# EAGLE design gps_transmitter_featherwing_v1.0 (EAGLE 7.7.0)
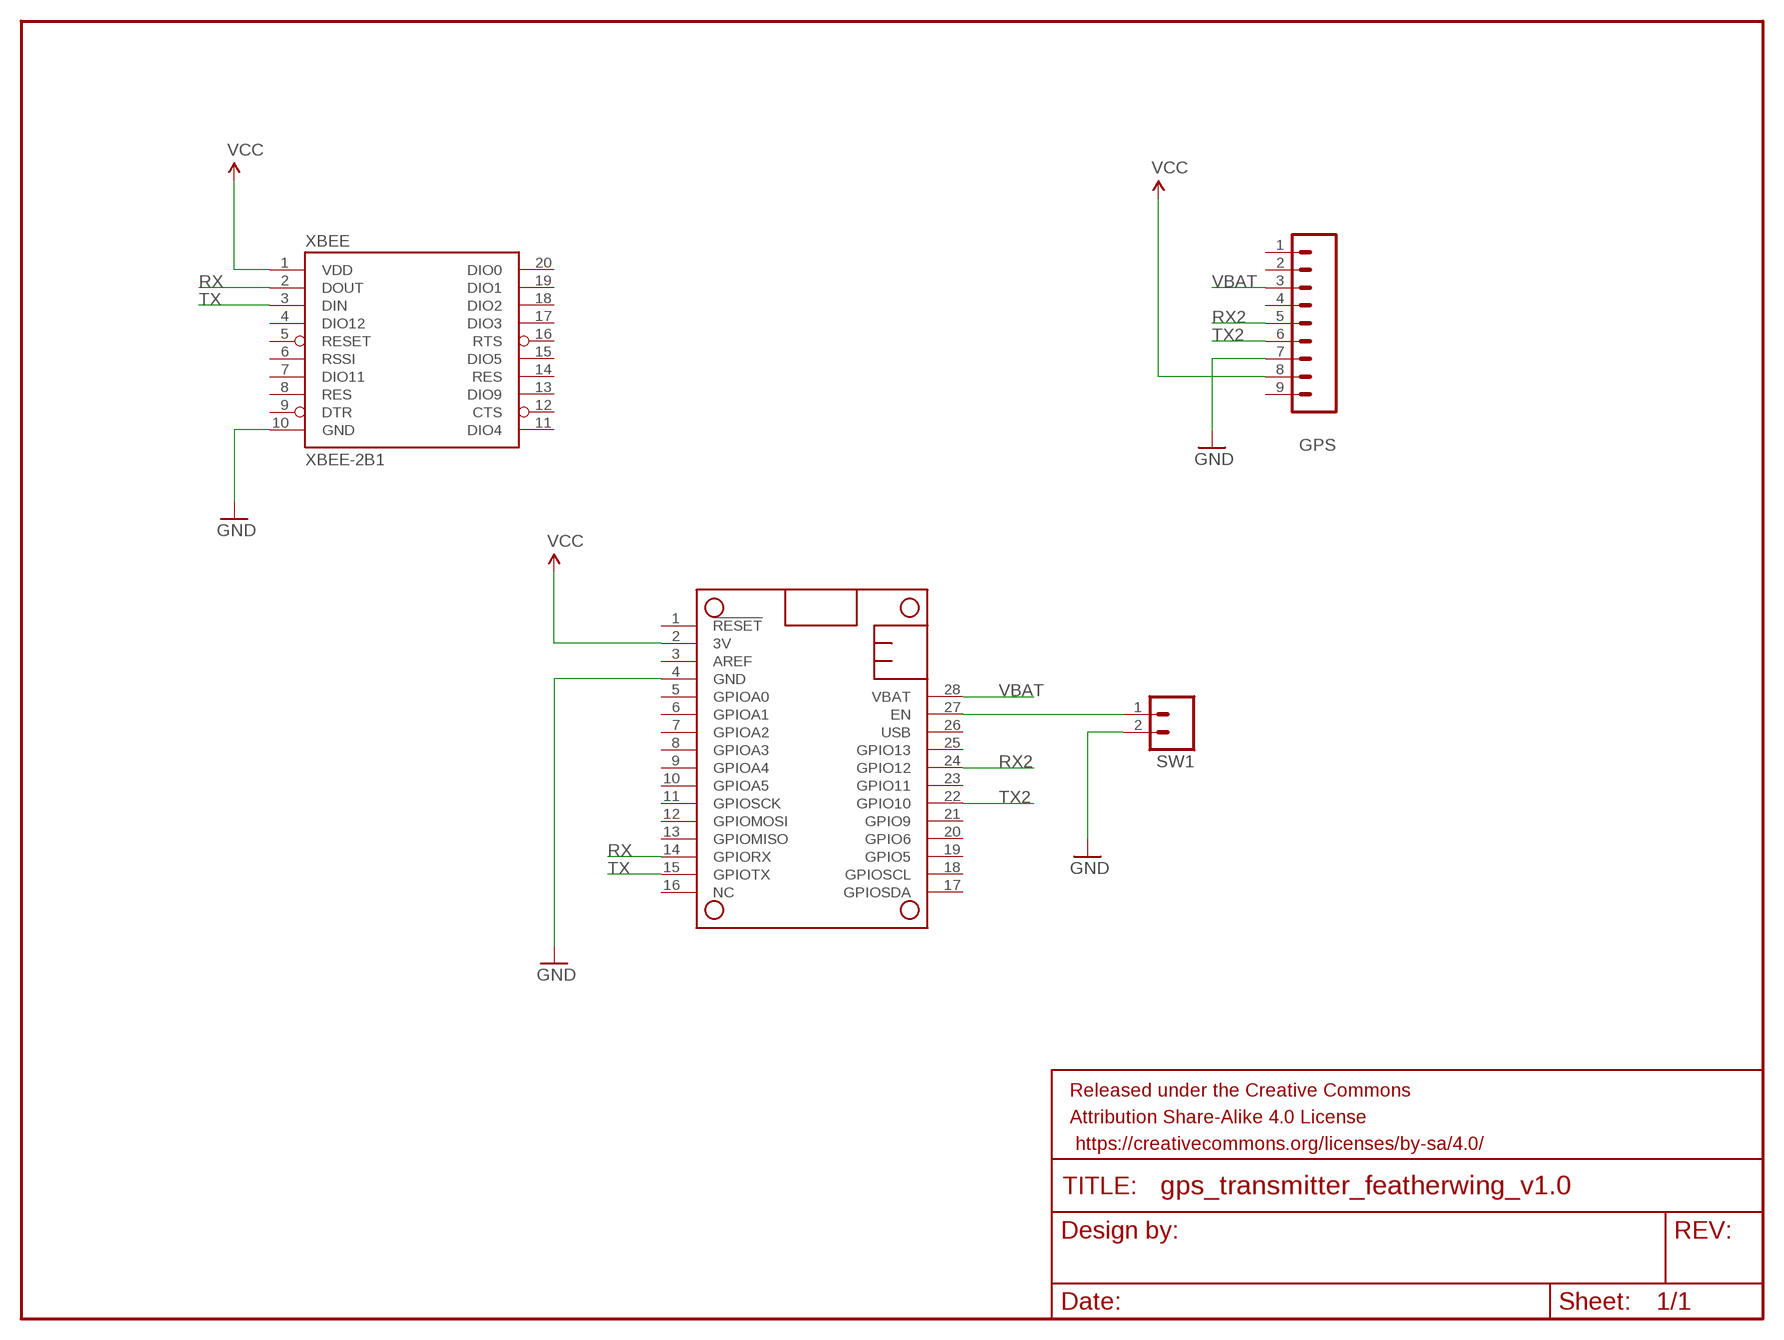
[diagram p0: schematic, sheet 1]

## Parts
FRAME1  FRAME-LETTER  [CREATIVE_COMMONS]
GPS  M09  [1X09]
MS1  FEATHERWING_NODIM  [FEATHERWING_DIM]
SW1  M023.5MM  [SCREWTERMINAL-3.5MM-2]
XBEE  XBEE-2B1  [XBEE-1]

## Nets
GND: GPS.7 MS1.4(GND) SW1.2 XBEE.10(GND)
N$3: MS1.27(EN) SW1.1
RX: MS1.14(GPIORX) XBEE.2(DOUT)
RX2: GPS.5 MS1.24(GPIO12)
TX: MS1.15(GPIOTX) XBEE.3(DIN)
TX2: GPS.6 MS1.22(GPIO10)
VBAT: GPS.3 MS1.28(VBAT)
VCC: GPS.8 MS1.2(3V) XBEE.1(VDD)
Unconnected: GPS.1 GPS.2 GPS.4 GPS.9 MS1.1(!RESET) MS1.3(AREF) MS1.5(GPIOA0) MS1.6(GPIOA1) MS1.7(GPIOA2) MS1.8(GPIOA3) MS1.9(GPIOA4) MS1.10(GPIOA5) MS1.11(GPIOSCK) MS1.12(GPIOMOSI) MS1.13(GPIOMISO) MS1.16(NC) MS1.17(GPIOSDA) MS1.18(GPIOSCL) MS1.19(GPIO5) MS1.20(GPIO6) MS1.21(GPIO9) MS1.23(GPIO11) MS1.25(GPIO13) MS1.26(USB) XBEE.4(DIO12) XBEE.5(RESET) XBEE.6(RSSI) XBEE.7(DIO11) XBEE.8(RES) XBEE.9(DTR) XBEE.11(DIO4) XBEE.12(CTS) XBEE.13(DIO9) XBEE.14(RES) XBEE.15(DIO5) XBEE.16(RTS) XBEE.17(DIO3) XBEE.18(DIO2) XBEE.19(DIO1) XBEE.20(DIO0)

## Library data of the parts
FRAME1 = SparkFun-Aesthetics:FRAME-LETTER: Schematic Frame Standard 8.5x11 US Letter frame
GPS = SparkFun-Connectors:M09: Header 9 Standard 9-pin 0.1" header. Use with straight break away headers (SKU : PRT-00116), right angle break away headers (PRT-00553), swiss pins (PRT-00743), machine pins (PRT-00117), and female headers (PRT-00115).
MS1 = adafruit:FEATHERWING
SW1 = SparkFun-Connectors:M02: Standard 2-pin 0.1" header. Use with - straight break away headers ( PRT-00116) - right angle break away headers (PRT-00553) - swiss pins (PRT-00743) - machine pins (PRT-00117) - female headers (PRT-00115) Molex polarized connector foot print use with: PRT-08233 with associated crimp pins and housings. 2.54_SCREWTERM for use with PRT-10571. 3.5mm Screw Terminal footprints for PRT-08084 5mm Screw Terminal footprints for use with PRT-08432; PROD_ID: CONN-08399
XBEE = SparkFun-RF:XBEE-2: Xbee module footprints SMT header is CONN-09042.

## Board
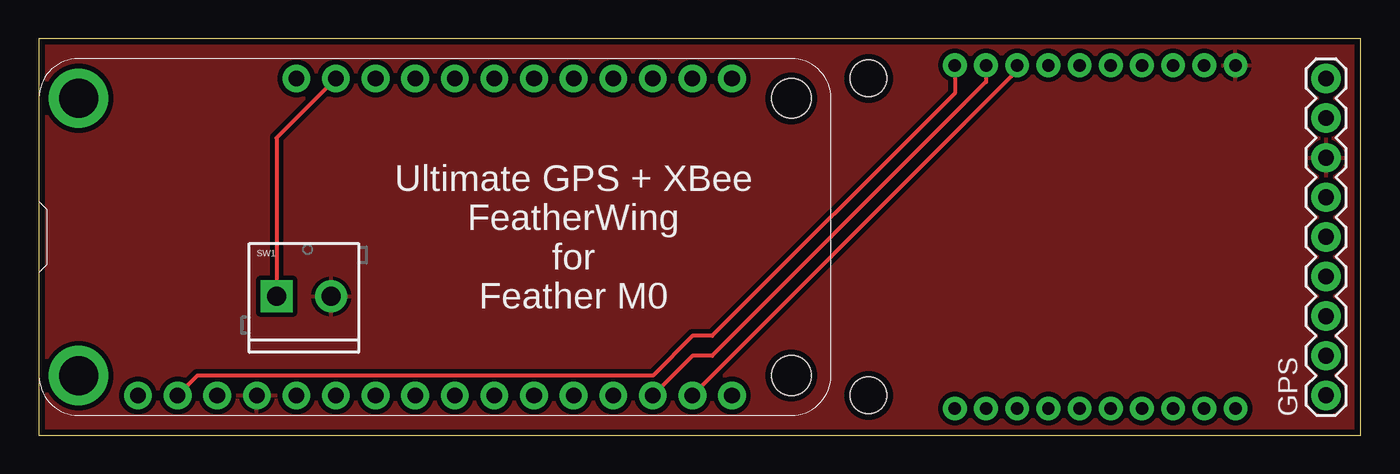
[diagram p1: board, top side]
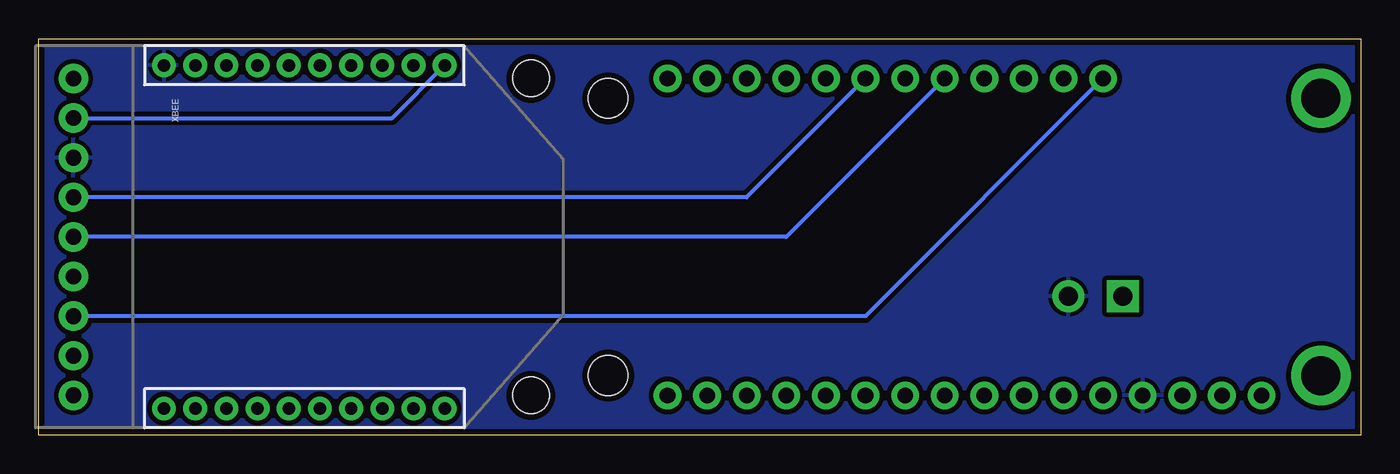
[diagram p2: board, bottom side, seen from below]

Size 84.76 x 25.39 mm. Coordinates in mm from the lower left corner, seen from the top.
Outline: 0,0 84.76,0 84.76,25.39 0,25.39 0,0
Copper layers (1*16): Top 0.0356mm / dielectric 1.5011mm / Bottom 0.0356mm
Design rules "oshpark-2layer": minimum track width 6mil, minimum drill 13mil, track to track 6mil, track to pad 6mil, pad to pad 6mil, via to via 6mil, smd to smd 6mil, copper to edge 15mil, drill to drill 6mil, minimum pad ring 7mil, minimum via ring 7mil, stop-mask expansion 2.5mil, vias tented up to drill 0mil, thermal gap 10mil
Holes 2.34 mm at 53.21,2.54 53.21,22.86

### Footprints (pad centres in the part's own frame; a part is rotated, then mirrored left to right if it is on the bottom)
1X09 = drill 1.016 pad 1.88: 1 0,0; 2 2.54,0; 3 5.08,0; 4 7.62,0; 5 10.16,0; 6 12.7,0; 7 15.24,0; 8 17.78,0; 9 20.32,0
FEATHERWING_DIM = drill 1 pad 1.778: 1 6.35,1.27; 2 8.89,1.27; 3 11.43,1.27; 4 13.97,1.27; 5 16.51,1.27; 6 19.05,1.27; 7 21.59,1.27; 8 24.13,1.27; 9 26.67,1.27; 10 29.21,1.27; 11 31.75,1.27; 12 34.29,1.27; 13 36.83,1.27; 14 39.37,1.27; 15 41.91,1.27; 16 44.45,1.27; 17 44.45,21.59; 18 41.91,21.59; 19 39.37,21.59; 20 36.83,21.59; 21 34.29,21.59; 22 31.75,21.59; 23 29.21,21.59; 24 26.67,21.59; 25 24.13,21.59; 26 21.59,21.59; 27 19.05,21.59; 28 16.51,21.59 | drill 2.5 pad 3.81: P$1 2.54,20.32; P$2 2.54,2.54 | hole 2.54: 48.26,20.32; 48.26,2.54
SCREWTERMINAL-3.5MM-2 = drill 1.2 pad 2.032 square: 1 0,0 | drill 1.2 pad 2.032: 2 3.5,0
XBEE-1 = drill 0.8 pad 1.524: 1 -11,20; 2 -11,18; 3 -11,16; 4 -11,14; 5 -11,12; 6 -11,10; 7 -11,8; 8 -11,6; 9 -11,4; 10 -11,2; 11 11,2; 12 11,4; 13 11,6; 14 11,8; 15 11,10; 16 11,12; 17 11,14; 18 11,16; 19 11,18; 20 11,20

### Placement (x,y rotation side)
FRAME1  8.89,-10.16 0 top  (outside the outline)
GPS  82.55,2.54 90 top
MS1  0,1.27 0 top
SW1  15.24,8.89 0 top
XBEE  78.74,12.7 270 bottom

### Tracks (layer width: path | path; a pad name or v marks a point on that pad's centre or on a via)
GND
  pour Top (isolate 0.305): 0,26.67 85.09,26.67 85.09,0 0,0
  pour Bottom (isolate 0.305): 0,25.4 85.09,25.4 85.09,-1.27 0,-1.27
N$3
  Top 0.254: MS1.27 15.24,19.05 SW1.1
RX
  Top 0.254: MS1.14 41.91,5.08 43.18,5.08 60.74,22.64 XBEE.2
RX2
  Bottom 0.254: MS1.24 36.83,12.7 GPS.5
TX
  Top 0.254: XBEE.3 62.74,23.37 MS1.15
TX2
  Bottom 0.254: MS1.22 39.37,15.24 GPS.6
VBAT
  Bottom 0.254: MS1.28 31.75,7.62 GPS.3
VCC
  Top 0.254: MS1.2 10.16,3.81 39.37,3.81 41.91,6.35 43.18,6.35 58.74,21.91 XBEE.1
  Bottom 0.254: GPS.8 62.12,20.32 XBEE.1

### Text on the board
tPlace: Ultimate GPS + XBee / FeatherWing / for / Feather M0